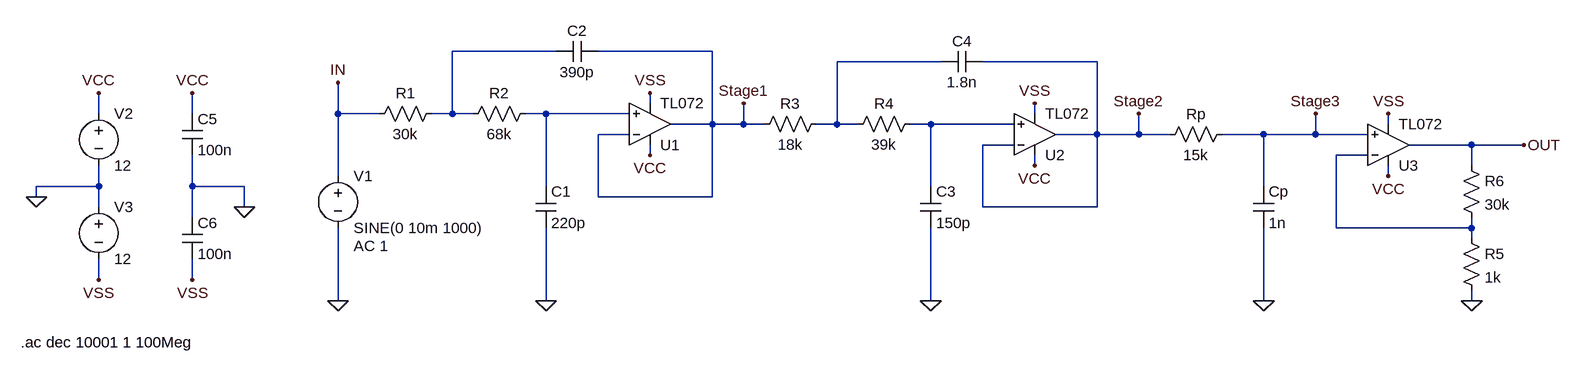
[diagram p0: schematic SK_ordnung5_10kHz_1dB_30dB_butter_3OPV.asc]
SK_ordnung5_10kHz_1dB_30dB_butter_3OPV.asc, the LTspice schematic file:
Version 4
SHEET 1 1396 736
WIRE -160 96 -320 96
WIRE 80 96 -96 96
WIRE 432 112 272 112
WIRE 672 112 496 112
WIRE -16 176 -16 160
WIRE -864 192 -864 160
WIRE -720 192 -720 160
WIRE -496 192 -496 144
WIRE -432 192 -496 192
WIRE -320 192 -320 96
WIRE -320 192 -352 192
WIRE -288 192 -320 192
WIRE -176 192 -208 192
WIRE -48 192 -176 192
WIRE 576 192 576 176
WIRE 80 208 80 96
WIRE 80 208 16 208
WIRE 128 208 128 176
WIRE 128 208 80 208
WIRE 160 208 128 208
WIRE 272 208 272 112
WIRE 272 208 240 208
WIRE 304 208 272 208
WIRE 416 208 384 208
WIRE 544 208 416 208
WIRE 1120 208 1120 192
WIRE -48 224 -96 224
WIRE 672 224 672 112
WIRE 672 224 608 224
WIRE 736 224 736 192
WIRE 736 224 672 224
WIRE 784 224 736 224
WIRE 928 224 864 224
WIRE 1008 224 1008 192
WIRE 1008 224 928 224
WIRE 1088 224 1008 224
WIRE 544 240 496 240
WIRE 1248 240 1152 240
WIRE 1328 240 1248 240
WIRE -16 256 -16 240
WIRE 1088 256 1040 256
WIRE 576 272 576 256
WIRE 1248 272 1248 240
WIRE -496 288 -496 192
WIRE 1120 288 1120 272
WIRE -864 304 -864 272
WIRE -864 304 -960 304
WIRE -720 304 -720 256
WIRE -640 304 -720 304
WIRE -176 304 -176 192
WIRE 416 304 416 208
WIRE 928 304 928 224
WIRE -960 320 -960 304
WIRE -96 320 -96 224
WIRE 80 320 80 208
WIRE 80 320 -96 320
WIRE -864 336 -864 304
WIRE -640 336 -640 304
WIRE 496 336 496 240
WIRE 672 336 672 224
WIRE 672 336 496 336
WIRE -720 352 -720 304
WIRE 1040 368 1040 256
WIRE 1248 368 1248 352
WIRE 1248 368 1040 368
WIRE 1248 384 1248 368
WIRE -864 448 -864 416
WIRE -720 448 -720 416
WIRE -496 480 -496 368
WIRE -176 480 -176 368
WIRE 416 480 416 368
WIRE 928 480 928 368
WIRE 1248 480 1248 464
FLAG 1248 480 0
FLAG 416 480 0
FLAG -176 480 0
FLAG -864 160 VCC
FLAG -864 448 VSS
FLAG -16 160 VSS
FLAG 576 176 VSS
FLAG 1120 192 VSS
FLAG -16 256 VCC
FLAG 576 272 VCC
FLAG 1120 288 VCC
FLAG -960 320 0
FLAG -720 160 VCC
FLAG -720 448 VSS
FLAG -640 336 0
FLAG -496 480 0
FLAG 1328 240 OUT
FLAG 736 192 Stage2
FLAG 128 176 Stage1
FLAG -496 144 IN
FLAG 928 480 0
FLAG 1008 192 Stage3
SYMBOL res 256 192 R90
WINDOW 0 0 56 VBottom 2
WINDOW 3 32 56 VTop 2
SYMATTR InstName R3
SYMATTR Value 18k
SYMBOL res 400 192 R90
WINDOW 0 0 56 VBottom 2
WINDOW 3 32 56 VTop 2
SYMATTR InstName R4
SYMATTR Value 39k
SYMBOL res 1232 368 R0
SYMATTR InstName R5
SYMATTR Value 1k
SYMBOL res 1232 256 R0
SYMATTR InstName R6
SYMATTR Value 30k
SYMBOL cap 400 304 R0
SYMATTR InstName C3
SYMATTR Value 150p
SYMBOL cap 496 96 R90
WINDOW 0 0 32 VBottom 2
WINDOW 3 32 32 VTop 2
SYMATTR InstName C4
SYMATTR Value 1.8n
SYMBOL res -336 176 R90
WINDOW 0 0 56 VBottom 2
WINDOW 3 32 56 VTop 2
SYMATTR InstName R1
SYMATTR Value 30k
SYMBOL res -192 176 R90
WINDOW 0 0 56 VBottom 2
WINDOW 3 32 56 VTop 2
SYMATTR InstName R2
SYMATTR Value 68k
SYMBOL cap -192 304 R0
SYMATTR InstName C1
SYMATTR Value 220p
SYMBOL cap -96 80 R90
WINDOW 0 0 32 VBottom 2
WINDOW 3 32 32 VTop 2
SYMATTR InstName C2
SYMATTR Value 390p
SYMBOL voltage -496 272 R0
WINDOW 123 24 124 Left 2
WINDOW 39 0 0 Left 0
SYMATTR Value2 AC 1
SYMATTR InstName V1
SYMATTR Value SINE(0 10m 1000)
SYMBOL voltage -864 176 R0
WINDOW 123 0 0 Left 0
WINDOW 39 0 0 Left 0
SYMATTR InstName V2
SYMATTR Value 12
SYMBOL voltage -864 320 R0
WINDOW 123 0 0 Left 0
WINDOW 39 0 0 Left 0
SYMATTR InstName V3
SYMATTR Value 12
SYMBOL cap -736 192 R0
SYMATTR InstName C5
SYMATTR Value 100n
SYMBOL cap -736 352 R0
SYMATTR InstName C6
SYMATTR Value 100n
SYMBOL TL072 -16 272 M180
SYMATTR InstName U1
SYMBOL TL072 576 288 M180
SYMATTR InstName U2
SYMBOL TL072 1120 304 M180
SYMATTR InstName U3
SYMBOL res 880 208 R90
WINDOW 0 0 56 VBottom 2
WINDOW 3 32 56 VTop 2
SYMATTR InstName Rp
SYMATTR Value 15k
SYMBOL cap 912 304 R0
SYMATTR InstName Cp
SYMATTR Value 1n
TEXT -984 544 Left 2 !.ac dec 10001 1 100Meg

The netlist it stands for:
* SK_ordnung5_10kHz_1dB_30dB_butter_3OPV.asc
R3 N002 Stage1 18k
R4 N004 N002 39k
R5 N005 0 1k
R6 OUT N005 30k
C3 N004 0 150p
C4 Stage2 N002 1.8n
R1 N001 IN 30k
R2 N003 N001 68k
C1 N003 0 220p
C2 Stage1 N001 390p
V1 IN 0 SINE(0 10m 1000) AC 1
V2 VCC 0 12
V3 0 VSS 12
C5 VCC 0 100n
C6 0 VSS 100n
* U1: TL072 (symbol TL072 not available, pins judged from their places): In+=N003 In-=Stage1 V+=VCC V-=VSS OUT=Stage1
* U2: TL072 (symbol TL072 not available, pins judged from their places): In+=N004 In-=Stage2 V+=VCC V-=VSS OUT=Stage2
* U3: TL072 (symbol TL072 not available, pins judged from their places): In+=Stage3 In-=N005 V+=VCC V-=VSS OUT=OUT
Rp Stage3 Stage2 15k
Cp Stage3 0 1n
.ac dec 10001 1 100Meg
.backanno
.end